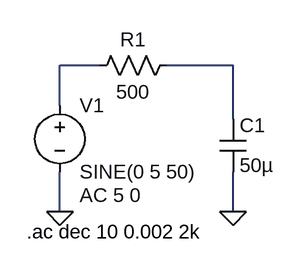
[diagram p0: schematic LPF.asc]
LPF.asc, the LTspice schematic file:
Version 4.1
SHEET 1 880 680
WIRE 224 48 176 48
WIRE 384 48 304 48
WIRE 176 96 176 48
WIRE 384 112 384 48
WIRE 176 224 176 176
WIRE 384 224 384 176
FLAG 176 224 0
FLAG 384 224 0
SYMBOL voltage 176 80 R0
WINDOW 123 24 124 Left 2
WINDOW 39 0 0 Left 0
SYMATTR InstName V1
SYMATTR Value SINE(0 5 50)
SYMATTR Value2 AC 5 0
SYMBOL res 320 32 R90
WINDOW 0 0 56 VBottom 2
WINDOW 3 32 56 VTop 2
SYMATTR InstName R1
SYMATTR Value 500
SYMBOL cap 368 112 R0
SYMATTR InstName C1
SYMATTR Value 50µ
TEXT 136 248 Left 2 !.ac dec 10 0.002 2k

The netlist it stands for:
* LPF.asc
V1 N001 0 SINE(0 5 50) AC 5 0
R1 N002 N001 500
C1 N002 0 50µ
.ac dec 10 0.002 2k
.backanno
.end